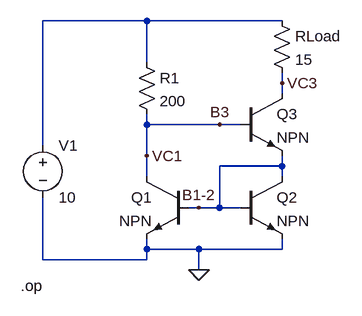
[diagram p0: schematic wilson.asc]
wilson.asc, the LTspice schematic file:
Version 4
SHEET 1 880 680
WIRE 80 -160 -80 -160
WIRE 288 -160 80 -160
WIRE 80 -96 80 -160
WIRE 288 -64 288 -80
WIRE 288 -48 288 -64
WIRE 80 0 80 -16
WIRE 192 0 80 0
WIRE 224 0 192 0
WIRE -80 32 -80 -160
WIRE 80 48 80 0
WIRE 288 64 288 48
WIRE 288 64 192 64
WIRE 80 80 80 48
WIRE 288 80 288 64
WIRE 160 128 144 128
WIRE 192 128 192 64
WIRE 192 128 160 128
WIRE 224 128 192 128
WIRE 80 192 80 176
WIRE 160 192 80 192
WIRE 288 192 288 176
WIRE 288 192 160 192
WIRE -80 208 -80 112
WIRE 80 208 80 192
WIRE 80 208 -80 208
WIRE 160 224 160 192
FLAG 160 224 0
FLAG 192 0 B3
FLAG 160 128 B1-2
FLAG 80 48 VC1
FLAG 288 -64 VC3
SYMBOL npn 144 80 M0
SYMATTR InstName Q1
SYMBOL npn 224 80 R0
SYMATTR InstName Q2
SYMBOL npn 224 -48 R0
SYMATTR InstName Q3
SYMBOL res 272 -176 R0
SYMATTR InstName RLoad
SYMATTR Value 15
SYMBOL res 64 -112 R0
SYMATTR InstName R1
SYMATTR Value 200
SYMBOL voltage -80 16 R0
WINDOW 123 0 0 Left 2
WINDOW 39 0 0 Left 2
SYMATTR InstName V1
SYMATTR Value 10
TEXT -114 248 Left 2 !.op

The netlist it stands for:
* wilson.asc
Q1 VC1 B1-2 0 0 NPN
Q2 B1-2 B1-2 0 0 NPN
Q3 VC3 VC1 B1-2 0 NPN
RLoad N001 VC3 15
R1 N001 VC1 200
V1 N001 0 10
.model NPN NPN
.model PNP PNP
.lib standard.bjt
.op
.backanno
.end